# EAGLE schematic sim-breakout (EAGLE 6.6.0)
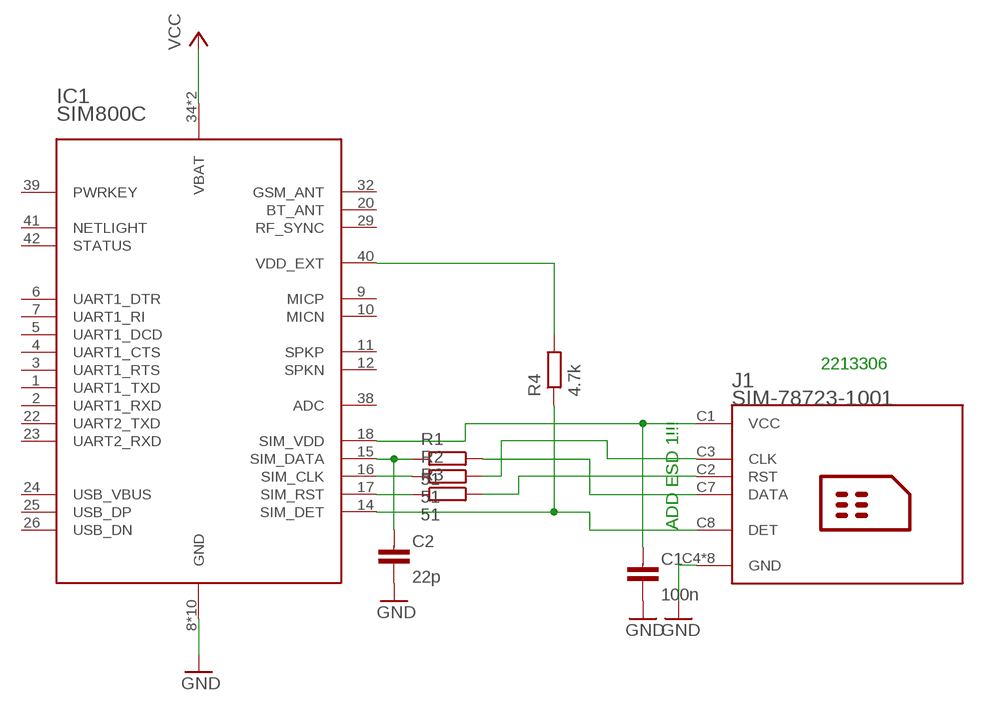
[diagram p0: schematic, sheet 1]

## Parts
C1  100n  CAPACITOR0603-N  [C0603-N]
C2  22p  CAPACITOR0603-N  [C0603-N]
IC1  SIM800C  [SIM800C]
J1  SIM-78723-1001  [MSIM-MOLEX]
R1  51  RESISTOR0603-N  [R0603-N]
R2  51  RESISTOR0603-N  [R0603-N]
R3  51  RESISTOR0603-N  [R0603-N]
R4  4.7k  RESISTOR0603-N  [R0603-N]

## Nets
GND: C1.2 C2.2 IC1.8(GND) IC1.13(GND) IC1.19(GND) IC1.21(GND) IC1.27(GND) IC1.30(GND) IC1.31(GND) IC1.33(GND) IC1.36(GND) IC1.37(GND) J1.C4(GND) J1.C5(GND) J1.GND1(GND) J1.GND2(GND) J1.GND3(GND) J1.GND4(GND) J1.GND5(GND) J1.GND6(GND)
N$1: C2.1 IC1.15(SIM_DATA) R1.1
N$2: IC1.16(SIM_CLK) R2.1
N$3: IC1.17(SIM_RST) R3.1
N$4: J1.C7(DATA) R1.2
N$5: J1.C2(RST) R3.2
N$6: J1.C3(CLK) R2.2
N$7: IC1.14(SIM_DET) J1.C8(DET) R4.1
N$8: IC1.40(VDD_EXT) R4.2
N$9: C1.1 IC1.18(SIM_VDD) J1.C1(VCC)
VCC: IC1.34(VBAT) IC1.35(VBAT)
Unconnected: IC1.1(UART1_TXD) IC1.2(UART1_RXD) IC1.3(UART1_RTS) IC1.4(UART1_CTS) IC1.5(UART1_DCD) IC1.6(UART1_DTR) IC1.7(UART1_RI) IC1.9(MICP) IC1.10(MICN) IC1.11(SPKP) IC1.12(SPKN) IC1.20(BT_ANT) IC1.22(UART2_TXD) IC1.23(UART2_RXD) IC1.25(USB_DP) IC1.26(USB_DN) IC1.29(RF_SYNC) IC1.32(GSM_ANT) IC1.38(ADC) IC1.39(PWRKEY) IC1.41(NETLIGHT) IC1.42(STATUS)

## Notes on the sheet
- 2213306
- ADD ESD 1!!!

## Power pins joined to a net without a drawn wire
USB_VBUS: IC1.24(USB_VBUS)

## Library data of the parts
C1 C2 = passives-7351:CAPACITOR
IC1 = TiLDA Mk4 Parts:SIM800C
J1 = TiLDA Mk4 Parts:SIM-78723-1001
R1-R4 = passives-7351:RESISTOR